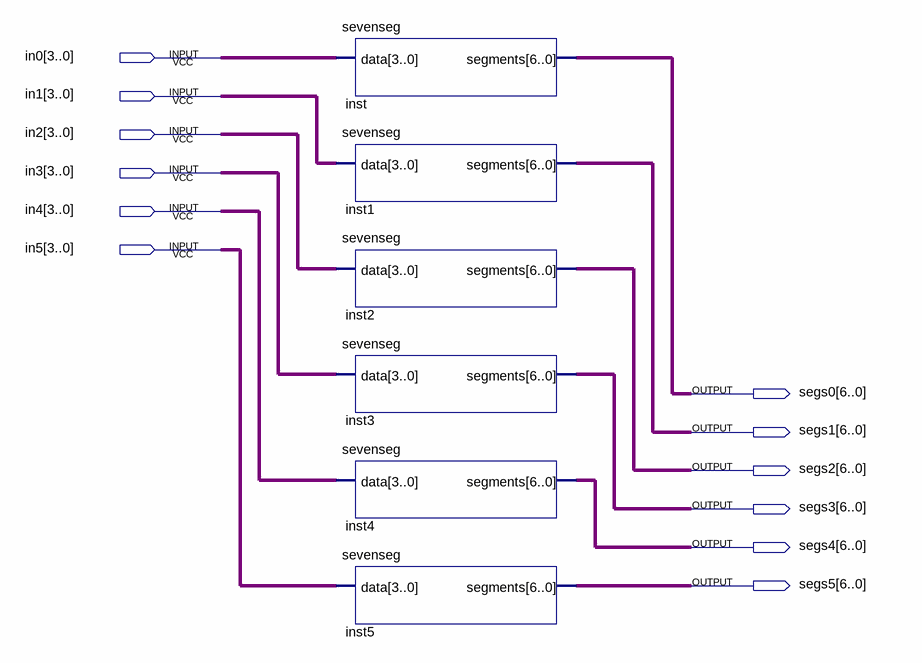
[diagram p0: schematic sheet]
// Quartus schematic seven_seg_6.bdf as structural Verilog: 6 symbols, 12 pins
module seven_seg_6 (
  input  [3:0] in0,
  input  [3:0] in1,
  input  [3:0] in2,
  input  [3:0] in3,
  input  [3:0] in4,
  input  [3:0] in5,
  output [6:0] segs0,
  output [6:0] segs1,
  output [6:0] segs2,
  output [6:0] segs3,
  output [6:0] segs4,
  output [6:0] segs5
);

  sevenseg inst (.data(in0), .segments(segs0));
  sevenseg inst1 (.data(in1), .segments(segs1));
  sevenseg inst2 (.data(in2), .segments(segs2));
  sevenseg inst3 (.data(in3), .segments(segs3));
  sevenseg inst4 (.data(in4), .segments(segs4));
  sevenseg inst5 (.data(in5), .segments(segs5));
endmodule
